# EAGLE design lithium_battery_manager_v11 (EAGLE 8.4.1)
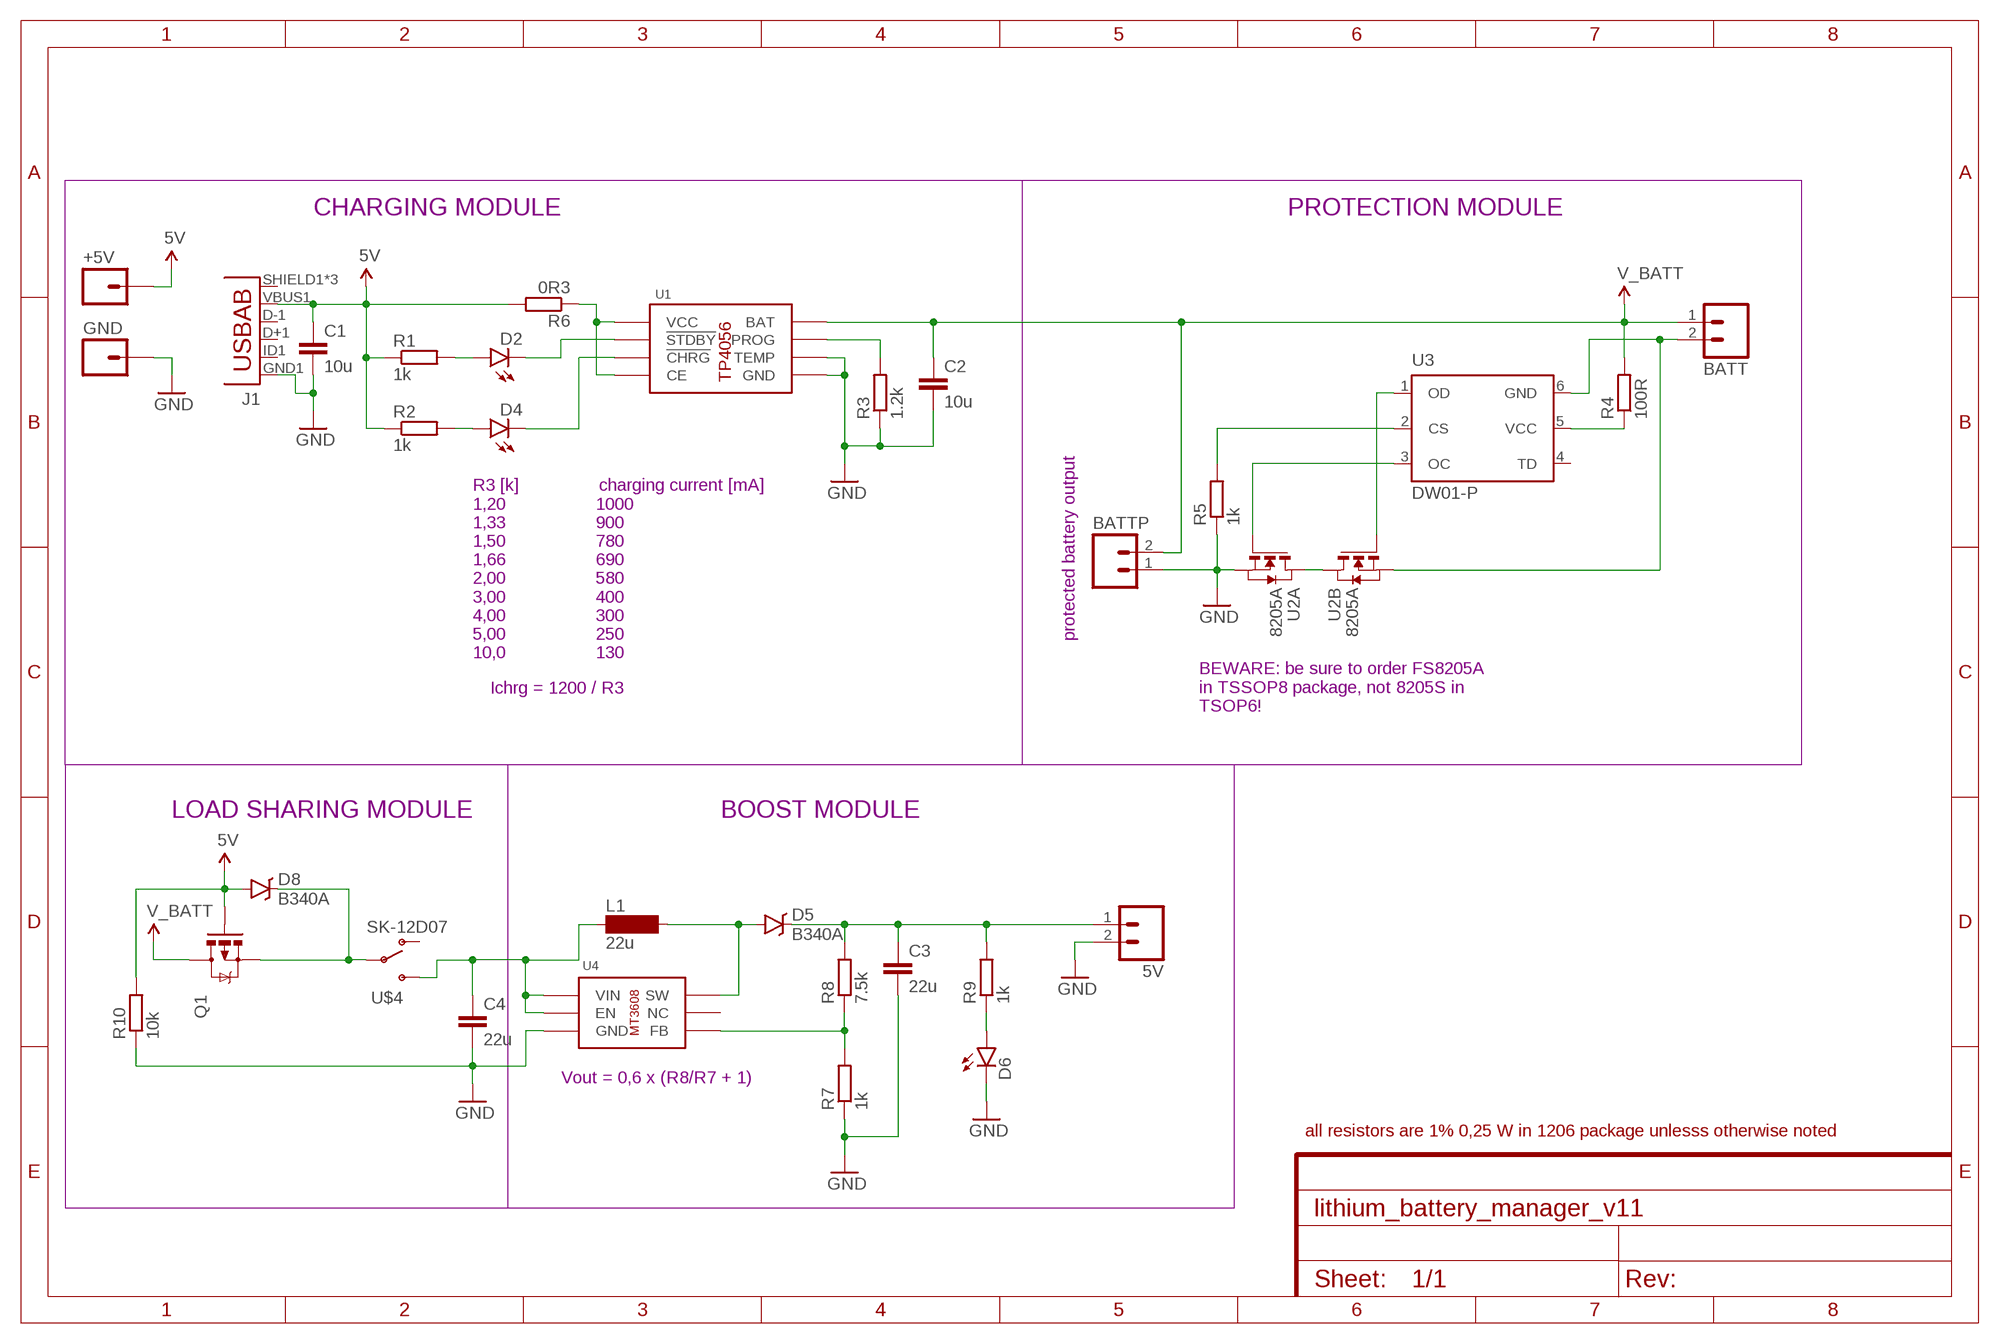
[diagram p0: schematic, sheet 1]
FRAME1 (FRAME-A4L): CNAME: Lithium Battery Utility Board; CREVISION: 1.1; DESIGNER: Martin DANEK, 2017

## Parts
5V  M02PTH3  [1X02_LONGPADS]
+5V  M01OFFSET  [1X01_OFFSET]
BATT  M02PTH3  [1X02_LONGPADS]
BATTP  M02PTH3  [1X02_LONGPADS]
C1  10u  C-EUC1206  [C1206]
C2  10u  C-EUC1206  [C1206]
C3  22u  C-EUC1206  [C1206]
C4  22u  C-EUC1206  [C1206]
D2  LED-CONN  [LED5MM]
D4  LED-CONN  [LED5MM]
D5  B340A  DIODE-SCHOTTKY-B340A  [SMA-DIODE]
D6  LED-CONN  [LED5MM]
D8  B340A  DIODE-SCHOTTKY-B340A  [SMA-DIODE]
GND  M01OFFSET  [1X01_OFFSET]
J1  USB-ABCONN-11794  [USB-AB-MICRO-SMD_V03]
L1  22u  MS85  [MS85]
Q1  MOSFET-PCHANNEL  [SOT23-3]
R1  1k  R-EU_R1206  [R1206]
R2  1k  R-EU_R1206  [R1206]
R3  1.2k  R-EU_R1206  [R1206]
R4  100R  R-EU_R1206  [R1206]
R5  1k  R-EU_R1206  [R1206]
R6  0R3  R-EU_R1206  [R1206]
R7  1k  R-EU_R1206  [R1206]
R8  7.5k  R-EU_R1206  [R1206]
R9  1k  R-EU_R1206  [R1206]
R10  10k  R-EU_R1206  [R1206]
U1  TP4056  [SOP8]
U2  8205A  [TSSOP8]
U3  DW01-P  [SOT23-6L]
U4  MT3608  [SOT23-6]
U$4  SK-12D07  [SK12SWITCH]

## Nets
5V: +5V.1 C1.1 D8.A J1.VBUS1(VBUS) Q1.1(G) R1.1 R2.1 R6.2 R10.2
GND: 5V.2 BATTP.1 C1.2 C2.2 C3.2 C4.2 D6.K(C) GND.1 J1.GND1(GND) R3.1 R5.1 R7.1 R10.1 U1.1(TEMP) U1.3(GND) U2.2(A:S) U2.3(A:S) U4.2(GND)
N$1: C4.1 L1.1 U4.4(EN) U4.5(VIN) U$4.IN(S)
N$2: D2.A R1.2
N$3: D2.K(C) U1.6(!STDBY)
N$4: D4.A R2.2
N$5: R3.2 U1.2(PROG)
N$6: R4.1 U3.5(VCC)
N$7: D4.K(C) U1.7(!CHRG)
N$8: BATT.2 U2.6(B:S) U2.7(B:S) U3.6(GND)
N$9: U2.1(A:D) U2.8(B:D)
N$10: U2.5(B:G) U3.1(OD)
N$11: U2.4(A:G) U3.3(OC)
N$12: D5.A L1.2 U4.1(SW)
N$13: R5.2 U3.2(CS)
N$14: R7.2 R8.1 U4.3(FB)
N$15: R6.1 U1.4(VCC) U1.8(CE)
N$16: D6.A R9.1
N$17: D8.C Q1.2(S) U$4.P2(P)
N$20: 5V.1 C3.1 D5.C R8.2 R9.2
V_BATT: BATT.1 BATTP.2 C2.1 Q1.3(D) R4.2 U1.5(BAT)
Unconnected: J1.D+1(D+) J1.D-1(D-) J1.ID1(USBID) J1.SHIELD1(SHIELD) J1.SHIELD2(SHIELD) J1.SHIELD3(SHIELD) U3.4(TD) U4.6(NC) U$4.P1(O)

## Notes on the sheet
- CHARGING MODULE | PROTECTION MODULE
- protected battery output
- R3 [k]                charging current [mA]
  1,20                  1000
  1,33                  900
  1,50                  780
  1,66                  690
  2,00                  580
  3,00                  400
  4,00                  300
  5,00                  250
  10,0                  130
- Ichrg = 1200 / R3
- BEWARE: be sure to order FS8205A
  in TSSOP8 package, not 8205S in 
  TSOP6!
- LOAD SHARING MODULE | BOOST MODULE
- Vout = 0,6 x (R8/R7 + 1)
- all resistors are 1% 0,25 W in 1206 package unlesss otherwise noted

## Library data of the parts
5V BATT BATTP = SparkFun-Connectors:M02: Standard 2-pin 0.1" header. Use with - straight break away headers ( PRT-00116) - right angle break away headers (PRT-00553) - swiss pins (PRT-00743) - machine pins (PRT-00117) - female headers (PRT-00115) Molex polarized connector foot print use with: PRT-08233 with associated crimp pins and housings. 2.54_SCREWTERM for use with PRT-10571. 3.5mm Screw Terminal footprints for PRT-08084 5mm Screw Terminal footprints for use with PRT-08432
+5V GND = SparkFun-Connectors:M01: Header 1 Standard 1-pin 0.1" header. Use with straight break away headers (SKU : PRT-00116), right angle break away headers (PRT-00553), swiss pins (PRT-00743), machine pins (PRT-00117), and female headers (PRT-00115). SMTSO-256-ET is a "flush mount" nut for a 4-40 screw. The older package used to be too tight, and did not allow it to sit properly thru the drill hit. The latest (0.165DIA) fits nice and snug.
C1-C4 = resistor:C-EU: CAPACITOR, European symbol
D2 D4 D6 = custom:LED-CONN
D5 D8 = SparkFun-DiscreteSemi:DIODE-SCHOTTKY: Schottky diodes in SFE's production catalog BAT20J 1A 23V 0.62Vf RB751 120mA 40V 0.37Vf PMEG4005EJ 0.5A 40V 0.42Vf MBRA140 1A 40V 0.5Vf B340A 3A 40V SMA; PROD_ID: DIO-09886
J1 = SparkFun-Connectors:USB-AB: This is a USB AB connector that is compatible with USB OTG. i.e. this connector can serve as a host or device; PROD_ID: CONN-11794
L1 = inductor-neosid:MS85: INDUCTOR SMD power inductor; OC_FARNELL: unknown; OC_NEWARK: unknown
Q1 = SparkFun-DiscreteSemi:MOSFET-PCHANNEL: Generic PMOSFET IRLML2244 - TRANS-11153 (SOT-23 -20V -4.3A) (1.Gate 2.Source 3.Drain) FQP27P06 - COM-10349 <http://www.sparkfun.com/products/10349> (TO-220 -60V -27A) (1.Gate 2.Source 3.Drain); PROD_ID: TRANS-08285
R1-R10 = resistor:R-EU_: RESISTOR, European symbol
U1 = custom:TP4056
U2 = lipo:8205A: DUAL N-CHANNEL MOSFET The 8205A uses advanced trench technology to provide excellent RDS(ON), low gate charge and operation with gate voltages as low as 2.5V. This device is suitable for use as a Battery protection or in other Switching application.
U3 = lipo:DW01-P: One Cell Lithium-ion/Polymer Battery Protection IC The DW01-P battery protection IC is designed to protect lithium-ion/polymer battery from damage or degrading the lifetime due to overcharge, overdischarge, and/or overcurrent for one-cell lithium-ion/polymer battery powered systems, such as cellular phones. The ultra-small package and less required external components make it ideal to integrate the DW01-P into the limited space of battery pack. The accurate ±50mV overcharging detection voltage ensures safe and full utilization charging. The very low standby current drains little current from the cell while in storage.
U4 = custom:MT3608
U$4 = custom:SK-12D07

## Board
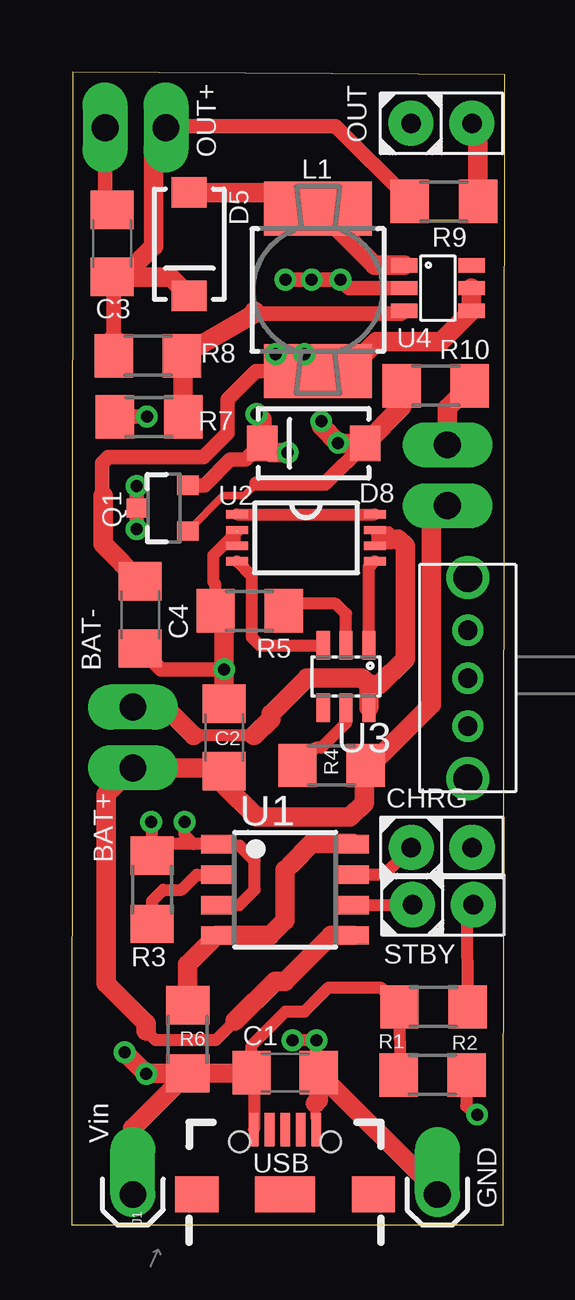
[diagram p1: board, top side]
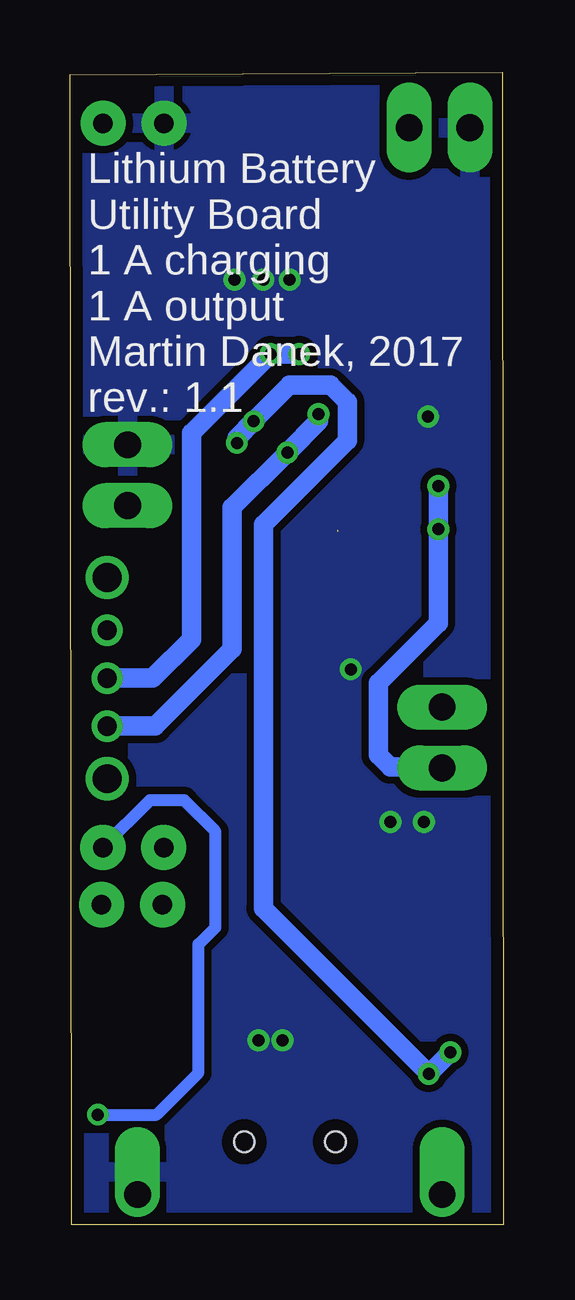
[diagram p2: board, bottom side, seen from below]

Size 18.06 x 48.04 mm. Coordinates in mm from the lower left corner, seen from the top.
Outline: 0,0 18,0 18.06,47.95 0.03,48.04 0,0
Copper layers (1*16): Top 0.035mm / dielectric 1.5mm / Bottom 0.035mm
Design rules "default *": minimum track width 6mil, minimum drill 0.35mm, track to track 6mil, track to pad 6mil, pad to pad 6mil, via to via 6mil, smd to smd 6mil, copper to edge 20mil, drill to drill 6mil, minimum pad ring 10mil, minimum via ring 8mil, stop-mask expansion 4mil, vias tented up to drill 0mil, thermal gap 10mil

### Footprints (pad centres in the part's own frame; a part is rotated, then mirrored left to right if it is on the bottom)
1X02_LONGPADS = drill 1.118 pad 1.88 long: 1 0,0; 2 2.54,0
1X01_OFFSET = drill 1.118 pad 1.88 offset: 1 0,0
C1206 = smd 1.6 x 1.8: 1 -1.4,0; 2 1.4,0
LED5MM = drill 0.813 pad 1.88: A -1.27,0; K 1.27,0
SMA-DIODE = smd 1.27 x 1.47: A -2.15,0; C 2.15,0
USB-AB-MICRO-SMD_V03 = smd 1.4 x 0.4: D+1 2.7,0; D-1 2.7,0.65; GND1 2.7,-1.3; ID1 2.7,-0.65; VBUS1 2.7,1.3 | smd 1.5 x 1.8: SHIELD1 0,3.68; SHIELD3 0,-3.68 | smd 1.5 x 2.5: SHIELD2 0,0 | hole 0.85: 2.2,1.9; 2.2,-1.9
MS85 = smd 4.5 x 2.25: 1 0,-3.383; 2 0,3.383
SOT23-3 = smd 0.8 x 0.9: 1 -0.95,-1; 2 0.95,-1; 3 0,1.1
R1206 = smd 1.6 x 1.803: 1 -1.422,0; 2 1.422,0
SOP8 = smd 0.76 x 1.27: 1 -1.905,-2.86; 2 -0.635,-2.86; 3 0.635,-2.86; 4 1.905,-2.86; 5 1.905,2.86; 6 0.635,2.86; 7 -0.635,2.86; 8 -1.905,2.86
TSSOP8 = smd 0.9 x 0.35: 1 -2.875,0.975; 2 -2.875,0.325; 3 -2.875,-0.325; 4 -2.875,-0.975; 5 2.875,-0.975; 6 2.875,-0.325; 7 2.875,0.325; 8 2.875,0.975
SOT23-6L = smd 0.55 x 1.2: 1 -0.95,-1.3; 2 0,-1.3; 3 0.95,-1.3; 4 0.95,1.3; 5 0,1.3; 6 -0.95,1.3
SOT23-6 = smd 0.6 x 1.1: 1 0,0; 2 0.95,0; 3 1.9,0; 4 1.9,2.8; 5 0.95,2.8; 6 0,2.8
SK12SWITCH = drill 0.8: IN 0,0; P1 0,2; P2 0,-2 | drill 1.2: PIN1 0,4.191; PIN2 0,-4.191

### Placement (x,y rotation side)
5V  3.92,45.74 180 top
+5V  2.54,1.27 0 top
BATT  2.54,19.05 90 top
BATTP  15.66,32.52 270 top
C1  8.89,6.35 0 top
C2  6.35,20.32 90 top
C3  1.68,40.91 90 top
C4  2.85,25.43 270 top
D2  15.47,13.35 180 top
D4  15.42,15.73 180 top
D5  4.89,40.88 270 top
D6  15.41,45.92 180 top
D8  10.08,32.58 180 top
GND  15.24,1.27 0 top
J1  8.89,1.27 90 top
L1  10.26,38.97 0 top
Q1  3.84,29.88 90 top
R1  15.08,9.09 0 top
R2  15.04,6.25 0 top
R3  3.34,13.97 270 top
R4  10.83,19.15 0 top
R5  7.41,25.6 0 top
R6  4.83,7.74 270 top
R7  3.22,33.68 0 top
R8  3.17,36.23 180 top
R9  15.51,42.66 180 top
R10  15.17,34.98 180 top
U1  8.89,13.97 270 top
U2  9.76,28.64 0 top
U3  11.43,22.86 180 top
U4  13.86,40 270 top
U$4  16.51,22.79 0 top

### Tracks (layer width: path | path; a pad name or v marks a point on that pad's centre or on a via)
5V  (via drill 0.5)
  Top 0.305: Q1.1 6.31,30.4 7.2,30.4 7.7,30.9
  Top 0.508: J1.VBUS1 7.59,6.25 C1.1 | C1.1 4.84,6.35 R6.2 | R2.1 13.68,6.29 R1.1 12.87,9.9 10.7,9.9 9.7,8.9 8.9,8.9 7.49,7.49 C1.1
  Top 0.61: 7.7,30.9 10.55,30.9 D8.A
  Top 0.813: R6.2 C1.1 7.59,6.25 | 2.54,3.81 +5V.1 2.54,4.03 R6.2 | 13.48,8.89 R1.1 | R10.2 13.75,34.1 D8.A 11.12,32.58 v11.1,32.6 10.4,33.3 v10.4,33.5 | R6.2 3.12,6.32 v3.1,6.3 v2.2,7.2
  Bottom 0.813: v2.2,7.2 v3.1,6.3 10,13.2 10,29.2 6.5,32.7 6.5,34.3 7.2,35 8.9,35 v10.4,33.5 11.1,32.8 v11.1,32.6
GND  (via drill 0.5)  (1 unrouted)
  Top 0.305: U2.2 U2.3
  Top 0.406: 10.16,5.08 10.16,4.45 10.19,4.42 J1.GND1
  Top 0.508: U1.3 6.99,13.34 7.62,13.97 7.62,15.18 7,15.8 6.11,15.8 U1.1 3.85,15.88 R3.1 3.34,16.76 v3.3,16.8 | C1.2 10.2,6.44 v10.2,7.7 v9.2,7.7 | 5.08,15.88 4.7,16.25 v4.7,16.8 | R5.1 5.99,26.71 5.9,26.8 5.9,27.91 6.88,28.9
  Top 0.61: U4.2 11.55,39.05 v11.2,39.4 v10,39.4 v8.9,39.4 | C3.2 1.38,42.61 5V.2 | R7.1 1.82,33.7 v3.13,33.7 | C4.2 3.72,23.16 v6.35,23.16
  Top 0.813: R3.1 3.23,15.37 2.9,15.7 | C2.2 v6.35,23.16 6.35,25.26 R5.1 | 10.16,5.08 10.29,5.21 C1.2 15.24,1.4 GND.1 | BATTP.1 15.66,34.05 R10.1
  pour Bottom (isolate 0.305): 0,0 0,48.26 17.78,48.26 17.78,0
N$1  (via drill 0.5)
  Top 0.61: L1.1 7.69,35.59 6.5,34.4 6.5,33 5.5,32 1.52,32 1.27,31.75 1.27,30.43 1.3,30.4
  Top 0.813: U4.5 U4.4 15.39,36.83 12.7,36.83 11.46,35.59 L1.1 | C4.1 1.3,28.38 1.3,30.4 | L1.1 9.7,36.15 v9.7,36.3 | L1.1 9.21,35.59 v8.5,36.3
  Bottom 0.813: v8.5,36.3 v9.7,36.3 13,33 13,24.4 14.61,22.79 U$4.IN
N$2
  Top 0.508: R1.2 16.48,13.09 D2.A
N$3
  Top 0.508: U1.6 14.19,13.34 D2.K
N$4  (via drill 0.5)
  Top 0.508: R2.2 16.44,4.96 16.8,4.6 v16.9,4.6
  Bottom 0.508: D4.A 14.72,17.7 13.3,17.7 12,16.4 12,12.4 12.7,11.7 12.7,6.35 14.45,4.6 v16.9,4.6
N$5
  Top 0.508: R3.2 3.34,13.5 3.81,13.97 4.57,13.97 5.2,14.6 U1.2
N$6
  Top 0.508: U3.5 11.43,20.93 10.4,19.9 10.18,19.9 R4.1
N$7
  Top 0.508: U1.7 13.03,14.61 D4.K
N$8
  Top 0.305: U2.7 13.23,28.96 13.6,28.6 | 12.74,28.32 U2.6 | 12.74,28.32 13.31,28.32 13.6,28.6 | 12.63,28.66 U2.7 | 12.63,28.66 12.63,28.43 12.74,28.32 | 13.18,28.6 13.1,28.6 | 13.18,28.6 13.6,28.6 | 13.1,28.6 12.69,28.6 12.63,28.66 | U2.7 12.73,28.96 13.1,28.6 | U2.7 12.82,28.96 13.18,28.6
  Top 0.508: 7.6,20.4 5.08,20.4
  Top 0.813: U3.6 12.38,22.52 | 12.38,22.52 12.1,22.8 9.8,22.8 8.3,21.3 8.3,21.1 7.6,20.4 | 12.38,22.52 12.82,22.52 13.9,23.6 13.9,28.3 13.6,28.6 | BATT.2 3.89,21.59 5.08,20.4
N$9
  Top 0.508: U2.1 U2.8
N$10
  Top 0.508: U3.1 12.38,27.41 U2.5
N$11
  Top 0.508: U2.4 7.5,27.05 7.5,24.5 7.84,24.16 U3.3
N$12
  Top 0.813: D5.A 9.58,43.03 L1.2 12.61,40 U4.1
N$13
  Top 0.508: U3.2 11.43,25.47 11,25.9 9.11,25.9 R5.2
N$14
  Top 0.61: U4.3 13.75,37.99 7.62,37.99
  Top 0.813: R7.2 4.64,36.18 R8.1 7.62,37.99 7.62,38.1
N$15
  Top 0.508: 8.89,14.79 9.12,15.02 | 10,15.9 10.16,15.9
  Top 0.813: R6.1 4.83,10.87 U1.4 8.26,12.06 8.89,12.7 8.89,14.79 | 9.12,15.02 10,15.9 | 10.16,15.9 11.72,15.9 U1.8
N$16
  Top 0.813: D6.A 16.93,45.67 R9.1
N$17  (via drill 0.5)
  Top 0.61: Q1.2 5.53,30.83 6.6,31.9 7.25,31.9 D8.C
  Top 0.813: v9,32.2 8.31,32.2 D8.C 7.93,33.57 v7.7,33.8
  Bottom 0.813: v7.7,33.8 7.7,33.5 v9,32.2 11.3,29.9 11.3,24 14.51,20.79 U$4.P2
N$20
  Top 0.61: R9.2 14.09,42.71 11,45.8 3.98,45.8 5V.1 | R8.2 1.75,39.44 C3.1
  Top 0.813: 1.75,36.96 R8.2 | 5V.1 3.4,45.22 3.4,40.8 2.11,39.51 C3.1 4.11,39.51 D5.C
V_BATT  (via drill 0.5)
  Top 0.508: 6.8,8.5 6,7.7 3.5,7.7 3.1,8.1
  Top 0.61: v2.7,30.8 2.7,29.92 Q1.3 2.7,29.84 v2.7,29
  Top 0.813: U1.5 10.79,12.06 8.89,10.16 8.46,10.16 6.8,8.5 | 3.1,8.1 3.1,8.4 1.43,10.07 1.43,17.94 BATT.1 6.22,19.05 C2.1 6.35,18.35 7.7,17 11.6,17 12.2,17.6 12.2,19.12 R4.2 | R4.2 | R4.2 12.45,19.15 15,21.7 15,29.32 BATTP.2
  Bottom 0.813: v2.7,30.8 v2.7,29 2.7,25.1 5.2,22.6 5.2,19.6 4.7,19.1 2.59,19.1 BATT.1

### Text on the board
tNames: OUT | OUT+ | U4 | BAT- | CHRG | BAT+ | STBY | Vin | USB | GND
bNames: Lithium Battery / Utility Board / 1 A charging / 1 A output / Martin Danek, 2017 / rev.: 1.1